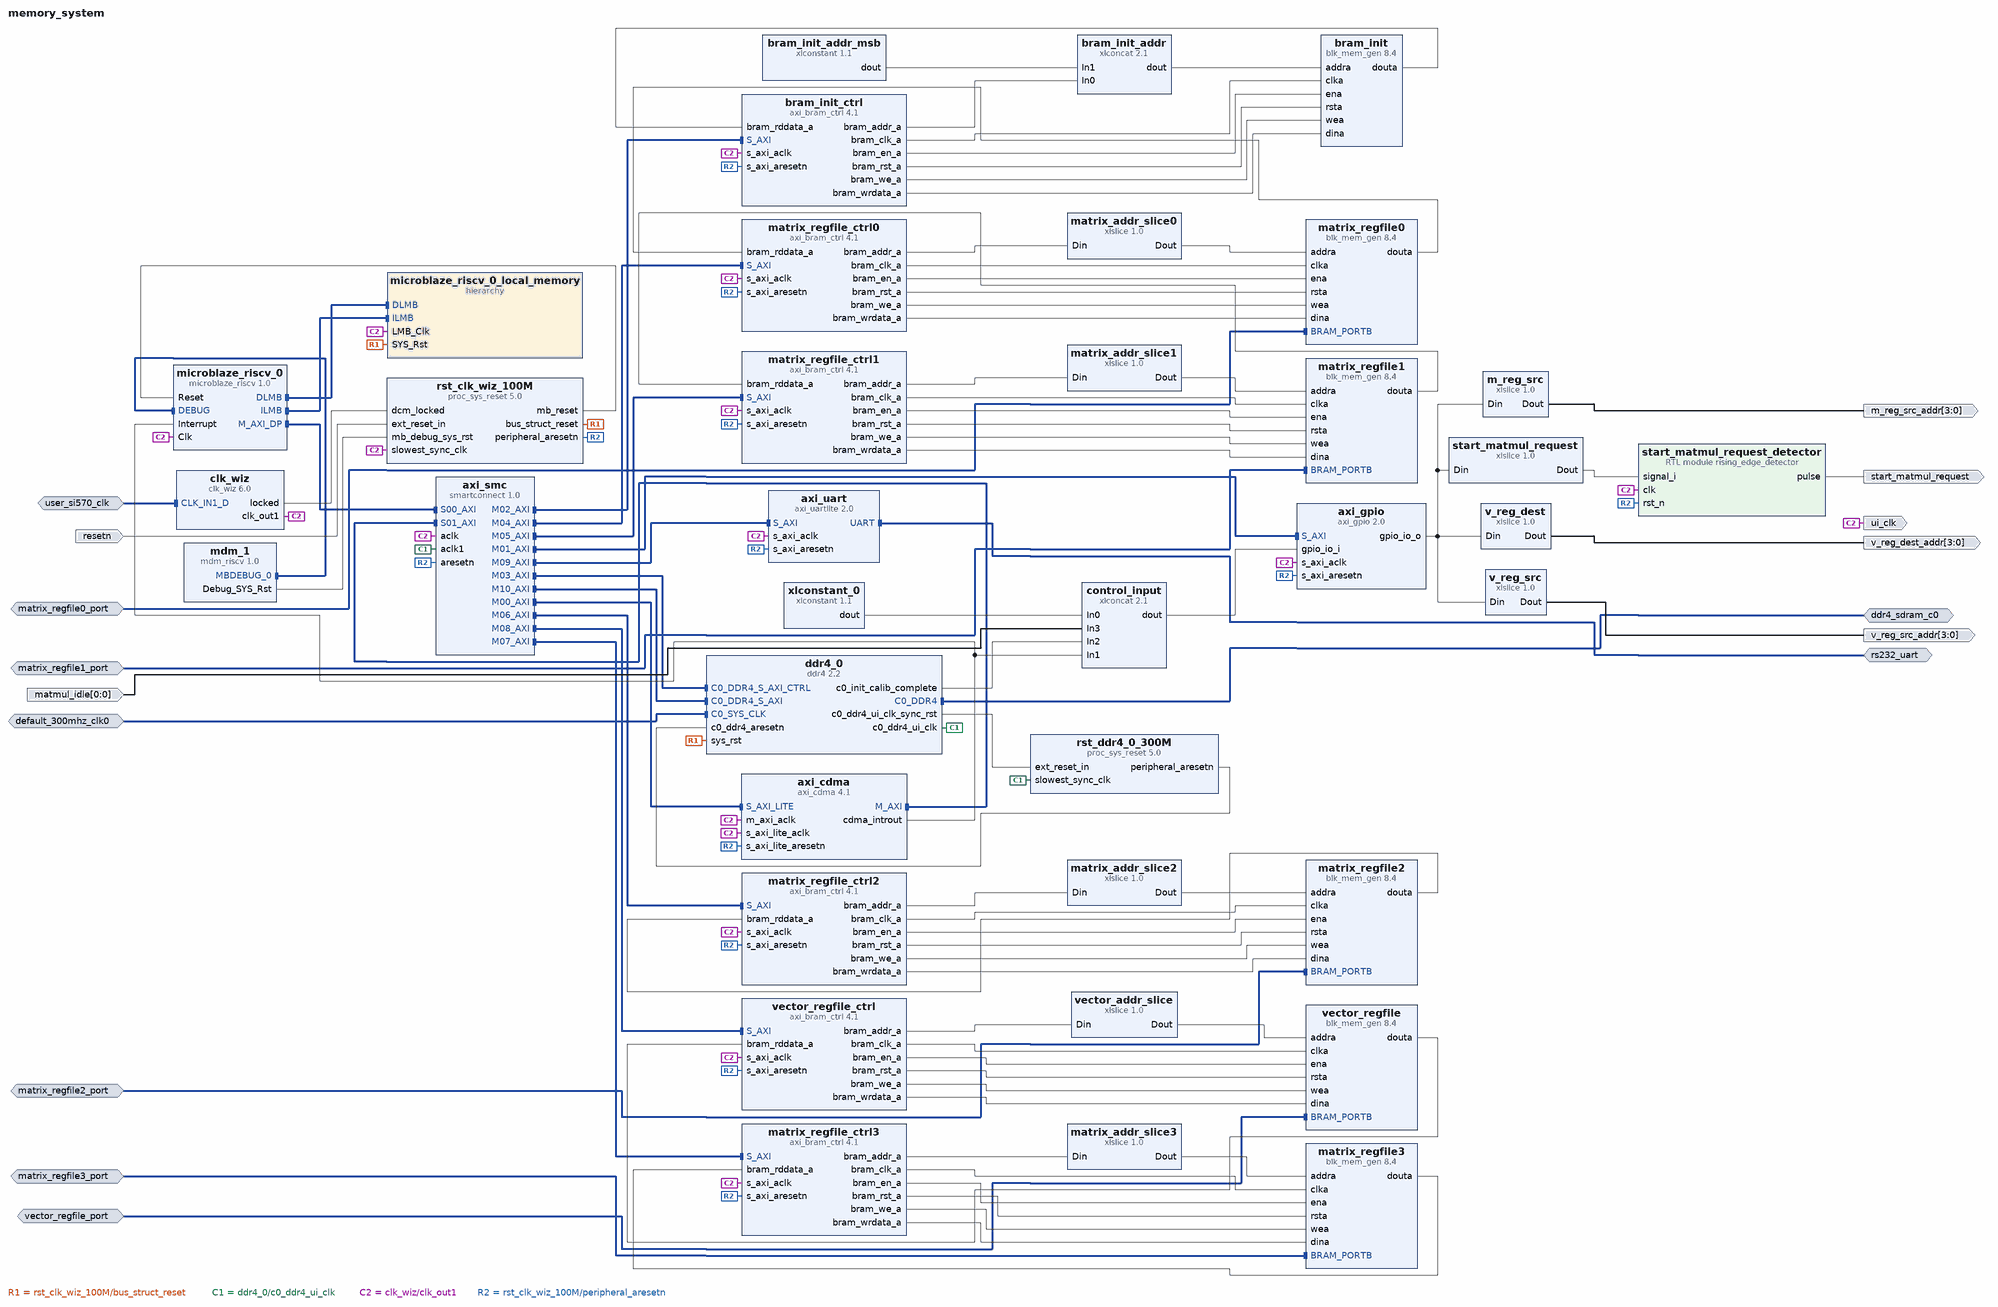
[diagram p0: block diagram of the top level]
# Vivado block design memory_system, xcu250-figd2104-2L-e, Vivado 2024.1
create_bd_design memory_system

create_bd_intf_port -mode Slave -vlnv xilinx.com:interface:diff_clock_rtl:1.0 default_300mhz_clk0
set_property -dict {CONFIG.FREQ_HZ 300000000} [get_bd_intf_ports default_300mhz_clk0]
create_bd_intf_port -mode Slave -vlnv xilinx.com:interface:bram_rtl:1.0 vector_regfile_port
create_bd_intf_port -mode Slave -vlnv xilinx.com:interface:bram_rtl:1.0 matrix_regfile0_port
create_bd_intf_port -mode Slave -vlnv xilinx.com:interface:bram_rtl:1.0 matrix_regfile1_port
create_bd_intf_port -mode Slave -vlnv xilinx.com:interface:bram_rtl:1.0 matrix_regfile2_port
create_bd_intf_port -mode Slave -vlnv xilinx.com:interface:bram_rtl:1.0 matrix_regfile3_port
create_bd_intf_port -mode Master -vlnv xilinx.com:interface:uart_rtl:1.0 rs232_uart
create_bd_intf_port -mode Master -vlnv xilinx.com:interface:ddr4_rtl:1.0 ddr4_sdram_c0
create_bd_intf_port -mode Slave -vlnv xilinx.com:interface:diff_clock_rtl:1.0 user_si570_clk
set_property -dict {CONFIG.FREQ_HZ 156250000} [get_bd_intf_ports user_si570_clk]
create_bd_port -dir I -type rst resetn
set_property -dict {CONFIG.POLARITY ACTIVE_LOW} [get_bd_ports resetn]
create_bd_port -dir O -type clk ui_clk
create_bd_port -dir O -from 3 -to 0 v_reg_src_addr
create_bd_port -dir O -from 3 -to 0 m_reg_src_addr
create_bd_port -dir O -from 3 -to 0 v_reg_dest_addr
create_bd_port -dir I -from 0 -to 0 matmul_idle
create_bd_port -dir O start_matmul_request

create_bd_cell -type ip -vlnv xilinx.com:ip:axi_cdma:4.1 axi_cdma
set_property -dict [list \
  CONFIG.C_ADDR_WIDTH 35 \
  CONFIG.C_INCLUDE_SG 0 \
  CONFIG.C_M_AXI_DATA_WIDTH 1024 \
  CONFIG.C_M_AXI_MAX_BURST_LEN 32 \
] [get_bd_cells axi_cdma]
create_bd_cell -type ip -vlnv xilinx.com:ip:axi_bram_ctrl:4.1 bram_init_ctrl
set_property -dict {CONFIG.DATA_WIDTH 1024 CONFIG.READ_LATENCY 1 CONFIG.SINGLE_PORT_BRAM 1} [get_bd_cells bram_init_ctrl]
create_bd_cell -type ip -vlnv xilinx.com:ip:blk_mem_gen:8.4 bram_init
set_property -dict [list \
  CONFIG.Coe_File ../../../../imports/mem_system.srcs/ram_init.coe \
  CONFIG.EN_SAFETY_CKT false \
  CONFIG.Enable_32bit_Address true \
  CONFIG.Fill_Remaining_Memory_Locations true \
  CONFIG.Load_Init_File true \
  CONFIG.Memory_Type Single_Port_RAM \
  CONFIG.Operating_Mode_A WRITE_FIRST \
  CONFIG.Register_PortA_Output_of_Memory_Core false \
  CONFIG.Register_PortA_Output_of_Memory_Primitives false \
  CONFIG.Remaining_Memory_Locations deadbeef \
  CONFIG.Use_RSTA_Pin true \
  CONFIG.Write_Depth_A 8192 \
  CONFIG.Write_Width_A 1024 \
  CONFIG.use_bram_block Stand_Alone \
] [get_bd_cells bram_init]
create_bd_cell -type ip -vlnv xilinx.com:ip:clk_wiz:6.0 clk_wiz
set_property -dict [list \
  CONFIG.AUTO_PRIMITIVE PLL \
  CONFIG.CLKIN1_JITTER_PS 64.0 \
  CONFIG.CLKOUT1_DRIVES Buffer \
  CONFIG.CLKOUT1_JITTER 87.637 \
  CONFIG.CLKOUT1_PHASE_ERROR 76.682 \
  CONFIG.CLKOUT1_REQUESTED_OUT_FREQ 200.89286 \
  CONFIG.CLKOUT2_DRIVES Buffer \
  CONFIG.CLKOUT3_DRIVES Buffer \
  CONFIG.CLKOUT4_DRIVES Buffer \
  CONFIG.CLKOUT5_DRIVES Buffer \
  CONFIG.CLKOUT6_DRIVES Buffer \
  CONFIG.CLKOUT7_DRIVES Buffer \
  CONFIG.CLK_IN1_BOARD_INTERFACE Custom \
  CONFIG.FEEDBACK_SOURCE FDBK_AUTO \
  CONFIG.MMCM_BANDWIDTH OPTIMIZED \
  CONFIG.MMCM_CLKFBOUT_MULT_F 9 \
  CONFIG.MMCM_CLKIN1_PERIOD 6.400 \
  CONFIG.MMCM_CLKIN2_PERIOD 10.000 \
  CONFIG.MMCM_CLKOUT0_DIVIDE_F 7 \
  CONFIG.MMCM_COMPENSATION AUTO \
  CONFIG.MMCM_DIVCLK_DIVIDE 1 \
  CONFIG.OPTIMIZE_CLOCKING_STRUCTURE_EN true \
  CONFIG.PHASESHIFT_MODE WAVEFORM \
  CONFIG.PRIMITIVE Auto \
  CONFIG.PRIM_IN_FREQ 156.250 \
  CONFIG.PRIM_SOURCE Differential_clock_capable_pin \
  CONFIG.RESET_BOARD_INTERFACE Custom \
  CONFIG.USE_BOARD_FLOW true \
  CONFIG.USE_LOCKED true \
  CONFIG.USE_RESET false \
] [get_bd_cells clk_wiz]
create_bd_cell -type ip -vlnv xilinx.com:ip:proc_sys_reset:5.0 rst_clk_wiz_100M
set_property -dict {CONFIG.RESET_BOARD_INTERFACE resetn CONFIG.USE_BOARD_FLOW true} [get_bd_cells rst_clk_wiz_100M]
create_bd_cell -type ip -vlnv xilinx.com:ip:axi_bram_ctrl:4.1 vector_regfile_ctrl
set_property -dict {CONFIG.DATA_WIDTH 1024 CONFIG.READ_LATENCY 1 CONFIG.SINGLE_PORT_BRAM 1} [get_bd_cells vector_regfile_ctrl]
create_bd_cell -type ip -vlnv xilinx.com:ip:blk_mem_gen:8.4 vector_regfile
set_property -dict [list \
  CONFIG.Byte_Size 8 \
  CONFIG.EN_SAFETY_CKT false \
  CONFIG.Enable_32bit_Address false \
  CONFIG.Fill_Remaining_Memory_Locations true \
  CONFIG.Load_Init_File false \
  CONFIG.Memory_Type True_Dual_Port_RAM \
  CONFIG.Operating_Mode_A WRITE_FIRST \
  CONFIG.Register_PortA_Output_of_Memory_Core false \
  CONFIG.Register_PortA_Output_of_Memory_Primitives false \
  CONFIG.Register_PortB_Output_of_Memory_Primitives true \
  CONFIG.Remaining_Memory_Locations 0 \
  CONFIG.Use_Byte_Write_Enable true \
  CONFIG.Use_RSTA_Pin true \
  CONFIG.Use_RSTB_Pin true \
  CONFIG.Write_Depth_A 16 \
  CONFIG.Write_Width_A 1024 \
  CONFIG.Write_Width_B 1024 \
  CONFIG.use_bram_block Stand_Alone \
] [get_bd_cells vector_regfile]
create_bd_cell -type ip -vlnv xilinx.com:ip:blk_mem_gen:8.4 matrix_regfile0
set_property -dict [list \
  CONFIG.Byte_Size 8 \
  CONFIG.EN_SAFETY_CKT false \
  CONFIG.Enable_32bit_Address false \
  CONFIG.Fill_Remaining_Memory_Locations true \
  CONFIG.Load_Init_File false \
  CONFIG.Memory_Type True_Dual_Port_RAM \
  CONFIG.Operating_Mode_A WRITE_FIRST \
  CONFIG.Register_PortA_Output_of_Memory_Core false \
  CONFIG.Register_PortA_Output_of_Memory_Primitives false \
  CONFIG.Register_PortB_Output_of_Memory_Primitives true \
  CONFIG.Remaining_Memory_Locations 0 \
  CONFIG.Use_Byte_Write_Enable true \
  CONFIG.Use_RSTA_Pin true \
  CONFIG.Use_RSTB_Pin true \
  CONFIG.Write_Depth_A 64 \
  CONFIG.Write_Width_A 1024 \
  CONFIG.Write_Width_B 4096 \
  CONFIG.use_bram_block Stand_Alone \
] [get_bd_cells matrix_regfile0]
create_bd_cell -type ip -vlnv xilinx.com:ip:axi_bram_ctrl:4.1 matrix_regfile_ctrl0
set_property -dict {CONFIG.DATA_WIDTH 1024 CONFIG.READ_LATENCY 1 CONFIG.SINGLE_PORT_BRAM 1} [get_bd_cells matrix_regfile_ctrl0]
create_bd_cell -type ip -vlnv xilinx.com:ip:xlslice:1.0 vector_addr_slice
set_property -dict {CONFIG.DIN_FROM 10 CONFIG.DIN_TO 7 CONFIG.DIN_WIDTH 16} [get_bd_cells vector_addr_slice]
create_bd_cell -type ip -vlnv xilinx.com:ip:xlslice:1.0 matrix_addr_slice0
set_property -dict {CONFIG.DIN_FROM 12 CONFIG.DIN_TO 7 CONFIG.DIN_WIDTH 16} [get_bd_cells matrix_addr_slice0]
create_bd_cell -type ip -vlnv xilinx.com:ip:xlslice:1.0 matrix_addr_slice1
set_property -dict {CONFIG.DIN_FROM 12 CONFIG.DIN_TO 7 CONFIG.DIN_WIDTH 16} [get_bd_cells matrix_addr_slice1]
create_bd_cell -type ip -vlnv xilinx.com:ip:blk_mem_gen:8.4 matrix_regfile1
set_property -dict [list \
  CONFIG.Byte_Size 8 \
  CONFIG.EN_SAFETY_CKT false \
  CONFIG.Enable_32bit_Address false \
  CONFIG.Fill_Remaining_Memory_Locations true \
  CONFIG.Load_Init_File false \
  CONFIG.Memory_Type True_Dual_Port_RAM \
  CONFIG.Operating_Mode_A WRITE_FIRST \
  CONFIG.Register_PortA_Output_of_Memory_Core false \
  CONFIG.Register_PortA_Output_of_Memory_Primitives false \
  CONFIG.Register_PortB_Output_of_Memory_Primitives true \
  CONFIG.Remaining_Memory_Locations 0 \
  CONFIG.Use_Byte_Write_Enable true \
  CONFIG.Use_RSTA_Pin true \
  CONFIG.Use_RSTB_Pin true \
  CONFIG.Write_Depth_A 64 \
  CONFIG.Write_Width_A 1024 \
  CONFIG.Write_Width_B 4096 \
  CONFIG.use_bram_block Stand_Alone \
] [get_bd_cells matrix_regfile1]
create_bd_cell -type ip -vlnv xilinx.com:ip:axi_bram_ctrl:4.1 matrix_regfile_ctrl1
set_property -dict {CONFIG.DATA_WIDTH 1024 CONFIG.READ_LATENCY 1 CONFIG.SINGLE_PORT_BRAM 1} [get_bd_cells matrix_regfile_ctrl1]
create_bd_cell -type ip -vlnv xilinx.com:ip:xlslice:1.0 matrix_addr_slice2
set_property -dict {CONFIG.DIN_FROM 12 CONFIG.DIN_TO 7 CONFIG.DIN_WIDTH 16} [get_bd_cells matrix_addr_slice2]
create_bd_cell -type ip -vlnv xilinx.com:ip:blk_mem_gen:8.4 matrix_regfile2
set_property -dict [list \
  CONFIG.Byte_Size 8 \
  CONFIG.EN_SAFETY_CKT false \
  CONFIG.Enable_32bit_Address false \
  CONFIG.Fill_Remaining_Memory_Locations true \
  CONFIG.Load_Init_File false \
  CONFIG.Memory_Type True_Dual_Port_RAM \
  CONFIG.Operating_Mode_A WRITE_FIRST \
  CONFIG.Read_Width_B 4096 \
  CONFIG.Register_PortA_Output_of_Memory_Core false \
  CONFIG.Register_PortA_Output_of_Memory_Primitives false \
  CONFIG.Remaining_Memory_Locations 0 \
  CONFIG.Use_Byte_Write_Enable true \
  CONFIG.Use_RSTA_Pin true \
  CONFIG.Use_RSTB_Pin true \
  CONFIG.Write_Depth_A 64 \
  CONFIG.Write_Width_A 1024 \
  CONFIG.Write_Width_B 4096 \
  CONFIG.use_bram_block Stand_Alone \
] [get_bd_cells matrix_regfile2]
create_bd_cell -type ip -vlnv xilinx.com:ip:axi_bram_ctrl:4.1 matrix_regfile_ctrl2
set_property -dict {CONFIG.DATA_WIDTH 1024 CONFIG.READ_LATENCY 1 CONFIG.SINGLE_PORT_BRAM 1} [get_bd_cells matrix_regfile_ctrl2]
create_bd_cell -type ip -vlnv xilinx.com:ip:xlslice:1.0 matrix_addr_slice3
set_property -dict {CONFIG.DIN_FROM 12 CONFIG.DIN_TO 7 CONFIG.DIN_WIDTH 16} [get_bd_cells matrix_addr_slice3]
create_bd_cell -type ip -vlnv xilinx.com:ip:blk_mem_gen:8.4 matrix_regfile3
set_property -dict [list \
  CONFIG.Byte_Size 8 \
  CONFIG.EN_SAFETY_CKT false \
  CONFIG.Enable_32bit_Address false \
  CONFIG.Fill_Remaining_Memory_Locations true \
  CONFIG.Load_Init_File false \
  CONFIG.Memory_Type True_Dual_Port_RAM \
  CONFIG.Operating_Mode_A WRITE_FIRST \
  CONFIG.Read_Width_B 4096 \
  CONFIG.Register_PortA_Output_of_Memory_Core false \
  CONFIG.Register_PortA_Output_of_Memory_Primitives false \
  CONFIG.Remaining_Memory_Locations 0 \
  CONFIG.Use_Byte_Write_Enable true \
  CONFIG.Use_RSTA_Pin true \
  CONFIG.Use_RSTB_Pin true \
  CONFIG.Write_Depth_A 64 \
  CONFIG.Write_Width_A 1024 \
  CONFIG.Write_Width_B 4096 \
  CONFIG.use_bram_block Stand_Alone \
] [get_bd_cells matrix_regfile3]
create_bd_cell -type ip -vlnv xilinx.com:ip:axi_bram_ctrl:4.1 matrix_regfile_ctrl3
set_property -dict {CONFIG.DATA_WIDTH 1024 CONFIG.READ_LATENCY 1 CONFIG.SINGLE_PORT_BRAM 1} [get_bd_cells matrix_regfile_ctrl3]
create_bd_cell -type ip -vlnv xilinx.com:ip:microblaze_riscv:1.0 microblaze_riscv_0
set_property -dict [list \
  CONFIG.C_DEBUG_ENABLED 1 \
  CONFIG.C_D_AXI 1 \
  CONFIG.C_D_LMB 1 \
  CONFIG.C_ENABLE_DISCRETE_PORTS 0 \
  CONFIG.C_I_LMB 1 \
  CONFIG.C_NUMBER_OF_PC_BRK 8 \
  CONFIG.C_NUMBER_OF_RD_ADDR_BRK 4 \
  CONFIG.C_NUMBER_OF_WR_ADDR_BRK 4 \
  CONFIG.G_TEMPLATE_LIST 1 \
] [get_bd_cells microblaze_riscv_0]
create_bd_cell -type hier microblaze_riscv_0_local_memory
create_bd_cell -type ip -vlnv xilinx.com:ip:mdm_riscv:1.0 mdm_1
create_bd_cell -type ip -vlnv xilinx.com:ip:axi_gpio:2.0 axi_gpio
set_property -dict [list \
  CONFIG.C_ALL_INPUTS 0 \
  CONFIG.C_ALL_OUTPUTS 0 \
  CONFIG.C_GPIO_WIDTH 32 \
  CONFIG.C_INTERRUPT_PRESENT 0 \
  CONFIG.GPIO_BOARD_INTERFACE Custom \
  CONFIG.USE_BOARD_FLOW true \
] [get_bd_cells axi_gpio]
create_bd_cell -type ip -vlnv xilinx.com:ip:smartconnect:1.0 axi_smc
set_property -dict {CONFIG.NUM_CLKS 2 CONFIG.NUM_MI 11} [get_bd_cells axi_smc]
create_bd_cell -type ip -vlnv xilinx.com:ip:axi_uartlite:2.0 axi_uart
set_property -dict [list \
  CONFIG.C_BAUDRATE 115200 \
  CONFIG.UARTLITE_BOARD_INTERFACE rs232_uart \
  CONFIG.USE_BOARD_FLOW true \
] [get_bd_cells axi_uart]
create_bd_cell -type ip -vlnv xilinx.com:ip:xlslice:1.0 v_reg_src
set_property -dict {CONFIG.DIN_FROM 3} [get_bd_cells v_reg_src]
create_bd_cell -type ip -vlnv xilinx.com:ip:xlslice:1.0 m_reg_src
set_property -dict {CONFIG.DIN_FROM 7 CONFIG.DIN_TO 4} [get_bd_cells m_reg_src]
create_bd_cell -type ip -vlnv xilinx.com:ip:xlslice:1.0 v_reg_dest
set_property -dict {CONFIG.DIN_FROM 11 CONFIG.DIN_TO 8} [get_bd_cells v_reg_dest]
create_bd_cell -type ip -vlnv xilinx.com:ip:xlslice:1.0 start_matmul_request
set_property -dict {CONFIG.DIN_FROM 12 CONFIG.DIN_TO 12} [get_bd_cells start_matmul_request]
create_bd_cell -type ip -vlnv xilinx.com:ip:xlconcat:2.1 control_input
set_property -dict {CONFIG.NUM_PORTS 4} [get_bd_cells control_input]
create_bd_cell -type ip -vlnv xilinx.com:ip:xlconstant:1.1 xlconstant_0
set_property -dict {CONFIG.CONST_VAL 0 CONFIG.CONST_WIDTH 29} [get_bd_cells xlconstant_0]
create_bd_cell -type ip -vlnv xilinx.com:ip:xlconcat:2.1 bram_init_addr
set_property -dict {CONFIG.IN0_WIDTH 16 CONFIG.IN1_WIDTH 16} [get_bd_cells bram_init_addr]
create_bd_cell -type ip -vlnv xilinx.com:ip:xlconstant:1.1 bram_init_addr_msb
set_property -dict {CONFIG.CONST_VAL 0 CONFIG.CONST_WIDTH 16} [get_bd_cells bram_init_addr_msb]
create_bd_cell -type ip -vlnv xilinx.com:ip:ddr4:2.2 ddr4_0
set_property -dict [list \
  CONFIG.ADDN_UI_CLKOUT1_FREQ_HZ None \
  CONFIG.ADDN_UI_CLKOUT2_FREQ_HZ None \
  CONFIG.C0.DDR4_AUTO_AP_COL_A3 true \
  CONFIG.C0.DDR4_Mem_Add_Map ROW_COLUMN_BANK_INTLV \
  CONFIG.C0_CLOCK_BOARD_INTERFACE default_300mhz_clk0 \
  CONFIG.C0_DDR4_BOARD_INTERFACE ddr4_sdram_c0 \
  CONFIG.RESET_BOARD_INTERFACE resetn \
] [get_bd_cells ddr4_0]
create_bd_cell -type ip -vlnv xilinx.com:ip:proc_sys_reset:5.0 rst_ddr4_0_300M
create_bd_cell -type module -reference rising_edge_detector start_matmul_request_detector

# ---- hierarchy /microblaze_riscv_0_local_memory ----
current_bd_instance /microblaze_riscv_0_local_memory
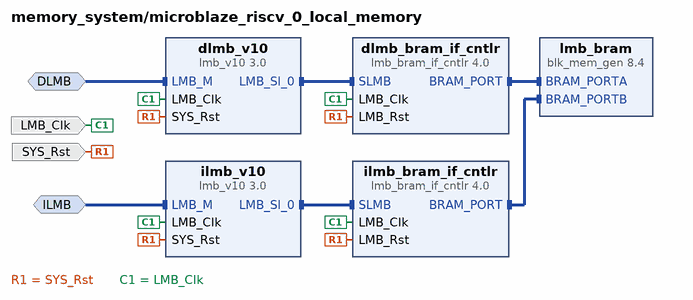
[diagram p1: block diagram inside /microblaze_riscv_0_local_memory]
create_bd_intf_pin -mode MirroredMaster -vlnv xilinx.com:interface:lmb_rtl:1.0 DLMB
create_bd_intf_pin -mode MirroredMaster -vlnv xilinx.com:interface:lmb_rtl:1.0 ILMB
create_bd_pin -dir I -type clk LMB_Clk
create_bd_pin -dir I -type rst SYS_Rst

create_bd_cell -type ip -vlnv xilinx.com:ip:lmb_v10:3.0 dlmb_v10
create_bd_cell -type ip -vlnv xilinx.com:ip:lmb_v10:3.0 ilmb_v10
create_bd_cell -type ip -vlnv xilinx.com:ip:lmb_bram_if_cntlr:4.0 dlmb_bram_if_cntlr
set_property -dict {CONFIG.C_ECC 0} [get_bd_cells dlmb_bram_if_cntlr]
create_bd_cell -type ip -vlnv xilinx.com:ip:lmb_bram_if_cntlr:4.0 ilmb_bram_if_cntlr
set_property -dict {CONFIG.C_ECC 0} [get_bd_cells ilmb_bram_if_cntlr]
create_bd_cell -type ip -vlnv xilinx.com:ip:blk_mem_gen:8.4 lmb_bram
set_property -dict {CONFIG.Memory_Type True_Dual_Port_RAM CONFIG.use_bram_block BRAM_Controller} [get_bd_cells lmb_bram]

# ---- connections ----

current_bd_instance /microblaze_riscv_0_local_memory
connect_bd_intf_net -intf_net microblaze_riscv_0_dlmb [get_bd_intf_pins dlmb_v10/LMB_M] [get_bd_intf_pins DLMB]
connect_bd_intf_net -intf_net microblaze_riscv_0_dlmb_bus [get_bd_intf_pins dlmb_v10/LMB_Sl_0] [get_bd_intf_pins dlmb_bram_if_cntlr/SLMB]
connect_bd_intf_net -intf_net microblaze_riscv_0_dlmb_cntlr [get_bd_intf_pins dlmb_bram_if_cntlr/BRAM_PORT] [get_bd_intf_pins lmb_bram/BRAM_PORTA]
connect_bd_intf_net -intf_net microblaze_riscv_0_ilmb [get_bd_intf_pins ilmb_v10/LMB_M] [get_bd_intf_pins ILMB]
connect_bd_intf_net -intf_net microblaze_riscv_0_ilmb_bus [get_bd_intf_pins ilmb_v10/LMB_Sl_0] [get_bd_intf_pins ilmb_bram_if_cntlr/SLMB]
connect_bd_intf_net -intf_net microblaze_riscv_0_ilmb_cntlr [get_bd_intf_pins ilmb_bram_if_cntlr/BRAM_PORT] [get_bd_intf_pins lmb_bram/BRAM_PORTB]
connect_bd_net [get_bd_pins SYS_Rst] \
  [get_bd_pins dlmb_v10/SYS_Rst] [get_bd_pins dlmb_bram_if_cntlr/LMB_Rst] [get_bd_pins ilmb_v10/SYS_Rst] \
  [get_bd_pins ilmb_bram_if_cntlr/LMB_Rst]
connect_bd_net -net microblaze_riscv_0_Clk [get_bd_pins LMB_Clk] \
  [get_bd_pins dlmb_v10/LMB_Clk] [get_bd_pins dlmb_bram_if_cntlr/LMB_Clk] [get_bd_pins ilmb_v10/LMB_Clk] \
  [get_bd_pins ilmb_bram_if_cntlr/LMB_Clk]
set_property HDL_ATTRIBUTE.BMM_INFO_ADDRESS_SPACE {byte  0x00000000 32 > memory_system microblaze_riscv_0_local_memory/lmb_bram} [get_bd_cells dlmb_bram_if_cntlr]
set_property HDL_ATTRIBUTE.KEEP_HIERARCHY yes [get_bd_cells dlmb_bram_if_cntlr]

current_bd_instance /
connect_bd_intf_net -intf_net BRAM_PORTB_1_1 [get_bd_intf_ports matrix_regfile0_port] [get_bd_intf_pins matrix_regfile0/BRAM_PORTB]
connect_bd_intf_net -intf_net BRAM_PORTB_2_1 [get_bd_intf_ports matrix_regfile1_port] [get_bd_intf_pins matrix_regfile1/BRAM_PORTB]
connect_bd_intf_net -intf_net BRAM_PORTB_3_1 [get_bd_intf_ports matrix_regfile2_port] [get_bd_intf_pins matrix_regfile2/BRAM_PORTB]
connect_bd_intf_net -intf_net BRAM_PORTB_4_1 [get_bd_intf_ports matrix_regfile3_port] [get_bd_intf_pins matrix_regfile3/BRAM_PORTB]
connect_bd_intf_net -intf_net CLK_IN1_D_0_1 [get_bd_intf_ports user_si570_clk] [get_bd_intf_pins clk_wiz/CLK_IN1_D]
connect_bd_intf_net [get_bd_intf_pins axi_cdma/M_AXI] [get_bd_intf_pins axi_smc/S01_AXI]
connect_bd_intf_net [get_bd_intf_pins axi_smc/M03_AXI] [get_bd_intf_pins ddr4_0/C0_DDR4_S_AXI_CTRL]
connect_bd_intf_net [get_bd_intf_pins axi_smc/M09_AXI] [get_bd_intf_pins axi_uart/S_AXI]
connect_bd_intf_net [get_bd_intf_pins axi_smc/M10_AXI] [get_bd_intf_pins ddr4_0/C0_DDR4_S_AXI]
connect_bd_intf_net -intf_net axi_uartlite_0_UART [get_bd_intf_ports rs232_uart] [get_bd_intf_pins axi_uart/UART]
connect_bd_intf_net [get_bd_intf_ports ddr4_sdram_c0] [get_bd_intf_pins ddr4_0/C0_DDR4]
connect_bd_intf_net -intf_net default_300mhz_clk0_1 [get_bd_intf_ports default_300mhz_clk0] [get_bd_intf_pins ddr4_0/C0_SYS_CLK]
connect_bd_intf_net [get_bd_intf_pins microblaze_riscv_0/M_AXI_DP] [get_bd_intf_pins axi_smc/S00_AXI]
connect_bd_intf_net [get_bd_intf_pins mdm_1/MBDEBUG_0] [get_bd_intf_pins microblaze_riscv_0/DEBUG]
connect_bd_intf_net [get_bd_intf_pins microblaze_riscv_0/DLMB] [get_bd_intf_pins microblaze_riscv_0_local_memory/DLMB]
connect_bd_intf_net [get_bd_intf_pins microblaze_riscv_0/ILMB] [get_bd_intf_pins microblaze_riscv_0_local_memory/ILMB]
connect_bd_intf_net -intf_net smartconnect_0_M00_AXI [get_bd_intf_pins axi_smc/M00_AXI] [get_bd_intf_pins axi_cdma/S_AXI_LITE]
connect_bd_intf_net -intf_net smartconnect_0_M01_AXI [get_bd_intf_pins axi_smc/M01_AXI] [get_bd_intf_pins axi_gpio/S_AXI]
connect_bd_intf_net -intf_net smartconnect_0_M02_AXI [get_bd_intf_pins axi_smc/M02_AXI] [get_bd_intf_pins bram_init_ctrl/S_AXI]
connect_bd_intf_net -intf_net smartconnect_0_M04_AXI [get_bd_intf_pins axi_smc/M04_AXI] [get_bd_intf_pins matrix_regfile_ctrl0/S_AXI]
connect_bd_intf_net -intf_net smartconnect_0_M05_AXI [get_bd_intf_pins axi_smc/M05_AXI] [get_bd_intf_pins matrix_regfile_ctrl1/S_AXI]
connect_bd_intf_net -intf_net smartconnect_0_M06_AXI [get_bd_intf_pins axi_smc/M06_AXI] [get_bd_intf_pins matrix_regfile_ctrl2/S_AXI]
connect_bd_intf_net -intf_net smartconnect_0_M07_AXI [get_bd_intf_pins axi_smc/M07_AXI] [get_bd_intf_pins matrix_regfile_ctrl3/S_AXI]
connect_bd_intf_net -intf_net smartconnect_0_M08_AXI [get_bd_intf_pins axi_smc/M08_AXI] [get_bd_intf_pins vector_regfile_ctrl/S_AXI]
connect_bd_intf_net [get_bd_intf_ports vector_regfile_port] [get_bd_intf_pins vector_regfile/BRAM_PORTB]
connect_bd_net -net In3_0_1 [get_bd_ports matmul_idle] [get_bd_pins control_input/In3]
connect_bd_net -net SYS_Rst_1 [get_bd_pins rst_clk_wiz_100M/bus_struct_reset] \
  [get_bd_pins microblaze_riscv_0_local_memory/SYS_Rst] [get_bd_pins ddr4_0/sys_rst]
connect_bd_net -net axi_bram_ctrl_0_bram1_douta [get_bd_pins vector_regfile/douta] [get_bd_pins vector_regfile_ctrl/bram_rddata_a]
connect_bd_net -net axi_bram_ctrl_0_bram_clk_a [get_bd_pins bram_init_ctrl/bram_clk_a] [get_bd_pins bram_init/clka]
connect_bd_net -net axi_bram_ctrl_0_bram_douta [get_bd_pins bram_init/douta] [get_bd_pins bram_init_ctrl/bram_rddata_a]
connect_bd_net -net axi_bram_ctrl_0_bram_en_a [get_bd_pins bram_init_ctrl/bram_en_a] [get_bd_pins bram_init/ena]
connect_bd_net -net axi_bram_ctrl_0_bram_rst_a [get_bd_pins bram_init_ctrl/bram_rst_a] [get_bd_pins bram_init/rsta]
connect_bd_net -net axi_bram_ctrl_0_bram_we_a [get_bd_pins bram_init_ctrl/bram_we_a] [get_bd_pins bram_init/wea]
connect_bd_net -net axi_bram_ctrl_0_bram_wrdata_a [get_bd_pins bram_init_ctrl/bram_wrdata_a] [get_bd_pins bram_init/dina]
connect_bd_net -net axi_bram_ctrl_1_bram_clk_a1 [get_bd_pins vector_regfile_ctrl/bram_clk_a] [get_bd_pins vector_regfile/clka]
connect_bd_net -net axi_bram_ctrl_1_bram_en_a1 [get_bd_pins vector_regfile_ctrl/bram_en_a] [get_bd_pins vector_regfile/ena]
connect_bd_net -net axi_bram_ctrl_1_bram_rst_a1 [get_bd_pins vector_regfile_ctrl/bram_rst_a] [get_bd_pins vector_regfile/rsta]
connect_bd_net -net axi_bram_ctrl_1_bram_we_a1 [get_bd_pins vector_regfile_ctrl/bram_we_a] [get_bd_pins vector_regfile/wea]
connect_bd_net -net axi_bram_ctrl_1_bram_wrdata_a1 [get_bd_pins vector_regfile_ctrl/bram_wrdata_a] [get_bd_pins vector_regfile/dina]
connect_bd_net [get_bd_pins axi_cdma/cdma_introut] [get_bd_pins microblaze_riscv_0/Interrupt] [get_bd_pins control_input/In1]
connect_bd_net [get_bd_pins axi_gpio/gpio_io_o] \
  [get_bd_pins v_reg_src/Din] [get_bd_pins m_reg_src/Din] [get_bd_pins v_reg_dest/Din] [get_bd_pins start_matmul_request/Din]
connect_bd_net [get_bd_pins bram_init_addr/dout] [get_bd_pins bram_init/addra]
connect_bd_net [get_bd_pins bram_init_addr_msb/dout] [get_bd_pins bram_init_addr/In1]
connect_bd_net [get_bd_pins bram_init_ctrl/bram_addr_a] [get_bd_pins bram_init_addr/In0]
connect_bd_net [get_bd_pins clk_wiz/locked] [get_bd_pins rst_clk_wiz_100M/dcm_locked]
connect_bd_net [get_bd_pins control_input/dout] [get_bd_pins axi_gpio/gpio_io_i]
connect_bd_net [get_bd_pins ddr4_0/c0_ddr4_ui_clk] [get_bd_pins axi_smc/aclk1] [get_bd_pins rst_ddr4_0_300M/slowest_sync_clk]
connect_bd_net [get_bd_pins ddr4_0/c0_ddr4_ui_clk_sync_rst] [get_bd_pins rst_ddr4_0_300M/ext_reset_in]
connect_bd_net [get_bd_pins ddr4_0/c0_init_calib_complete] [get_bd_pins control_input/In2]
connect_bd_net [get_bd_pins m_reg_src/Dout] [get_bd_ports m_reg_src_addr]
connect_bd_net -net matrix_regfile_ctrl_bram_addr_a [get_bd_pins matrix_regfile_ctrl0/bram_addr_a] [get_bd_pins matrix_addr_slice0/Din]
connect_bd_net -net matrix_regfile_ctrl_bram_addr_a1 [get_bd_pins matrix_regfile_ctrl1/bram_addr_a] [get_bd_pins matrix_addr_slice1/Din]
connect_bd_net -net matrix_regfile_ctrl_bram_addr_a2 [get_bd_pins matrix_regfile_ctrl2/bram_addr_a] [get_bd_pins matrix_addr_slice2/Din]
connect_bd_net -net matrix_regfile_ctrl_bram_addr_a3 [get_bd_pins matrix_regfile_ctrl3/bram_addr_a] [get_bd_pins matrix_addr_slice3/Din]
connect_bd_net -net matrix_regfile_ctrl_bram_clk_a [get_bd_pins matrix_regfile_ctrl0/bram_clk_a] [get_bd_pins matrix_regfile0/clka]
connect_bd_net -net matrix_regfile_ctrl_bram_clk_a1 [get_bd_pins matrix_regfile_ctrl1/bram_clk_a] [get_bd_pins matrix_regfile1/clka]
connect_bd_net -net matrix_regfile_ctrl_bram_clk_a2 [get_bd_pins matrix_regfile_ctrl2/bram_clk_a] [get_bd_pins matrix_regfile2/clka]
connect_bd_net -net matrix_regfile_ctrl_bram_clk_a3 [get_bd_pins matrix_regfile_ctrl3/bram_clk_a] [get_bd_pins matrix_regfile3/clka]
connect_bd_net -net matrix_regfile_ctrl_bram_en_a [get_bd_pins matrix_regfile_ctrl0/bram_en_a] [get_bd_pins matrix_regfile0/ena]
connect_bd_net -net matrix_regfile_ctrl_bram_en_a1 [get_bd_pins matrix_regfile_ctrl1/bram_en_a] [get_bd_pins matrix_regfile1/ena]
connect_bd_net -net matrix_regfile_ctrl_bram_en_a2 [get_bd_pins matrix_regfile_ctrl2/bram_en_a] [get_bd_pins matrix_regfile2/ena]
connect_bd_net -net matrix_regfile_ctrl_bram_en_a3 [get_bd_pins matrix_regfile_ctrl3/bram_en_a] [get_bd_pins matrix_regfile3/ena]
connect_bd_net -net matrix_regfile_ctrl_bram_rst_a [get_bd_pins matrix_regfile_ctrl0/bram_rst_a] [get_bd_pins matrix_regfile0/rsta]
connect_bd_net -net matrix_regfile_ctrl_bram_rst_a1 [get_bd_pins matrix_regfile_ctrl1/bram_rst_a] [get_bd_pins matrix_regfile1/rsta]
connect_bd_net -net matrix_regfile_ctrl_bram_rst_a2 [get_bd_pins matrix_regfile_ctrl2/bram_rst_a] [get_bd_pins matrix_regfile2/rsta]
connect_bd_net -net matrix_regfile_ctrl_bram_rst_a3 [get_bd_pins matrix_regfile_ctrl3/bram_rst_a] [get_bd_pins matrix_regfile3/rsta]
connect_bd_net -net matrix_regfile_ctrl_bram_we_a [get_bd_pins matrix_regfile_ctrl0/bram_we_a] [get_bd_pins matrix_regfile0/wea]
connect_bd_net -net matrix_regfile_ctrl_bram_we_a1 [get_bd_pins matrix_regfile_ctrl1/bram_we_a] [get_bd_pins matrix_regfile1/wea]
connect_bd_net -net matrix_regfile_ctrl_bram_we_a2 [get_bd_pins matrix_regfile_ctrl2/bram_we_a] [get_bd_pins matrix_regfile2/wea]
connect_bd_net -net matrix_regfile_ctrl_bram_we_a3 [get_bd_pins matrix_regfile_ctrl3/bram_we_a] [get_bd_pins matrix_regfile3/wea]
connect_bd_net -net matrix_regfile_ctrl_bram_wrdata_a [get_bd_pins matrix_regfile_ctrl0/bram_wrdata_a] [get_bd_pins matrix_regfile0/dina]
connect_bd_net -net matrix_regfile_ctrl_bram_wrdata_a1 [get_bd_pins matrix_regfile_ctrl1/bram_wrdata_a] [get_bd_pins matrix_regfile1/dina]
connect_bd_net -net matrix_regfile_ctrl_bram_wrdata_a2 [get_bd_pins matrix_regfile_ctrl2/bram_wrdata_a] [get_bd_pins matrix_regfile2/dina]
connect_bd_net -net matrix_regfile_ctrl_bram_wrdata_a3 [get_bd_pins matrix_regfile_ctrl3/bram_wrdata_a] [get_bd_pins matrix_regfile3/dina]
connect_bd_net -net matrix_regfile_douta [get_bd_pins matrix_regfile0/douta] [get_bd_pins matrix_regfile_ctrl0/bram_rddata_a]
connect_bd_net -net matrix_regfile_douta1 [get_bd_pins matrix_regfile1/douta] [get_bd_pins matrix_regfile_ctrl1/bram_rddata_a]
connect_bd_net -net matrix_regfile_douta2 [get_bd_pins matrix_regfile2/douta] [get_bd_pins matrix_regfile_ctrl2/bram_rddata_a]
connect_bd_net -net matrix_regfile_douta3 [get_bd_pins matrix_regfile3/douta] [get_bd_pins matrix_regfile_ctrl3/bram_rddata_a]
connect_bd_net [get_bd_pins mdm_1/Debug_SYS_Rst] [get_bd_pins rst_clk_wiz_100M/mb_debug_sys_rst]
connect_bd_net -net microblaze_riscv_0_Clk [get_bd_pins clk_wiz/clk_out1] \
  [get_bd_pins axi_cdma/m_axi_aclk] [get_bd_pins bram_init_ctrl/s_axi_aclk] [get_bd_pins rst_clk_wiz_100M/slowest_sync_clk] \
  [get_bd_pins axi_cdma/s_axi_lite_aclk] [get_bd_pins vector_regfile_ctrl/s_axi_aclk] \
  [get_bd_pins matrix_regfile_ctrl0/s_axi_aclk] [get_bd_pins matrix_regfile_ctrl1/s_axi_aclk] \
  [get_bd_pins matrix_regfile_ctrl2/s_axi_aclk] [get_bd_pins matrix_regfile_ctrl3/s_axi_aclk] \
  [get_bd_pins microblaze_riscv_0/Clk] [get_bd_pins microblaze_riscv_0_local_memory/LMB_Clk] \
  [get_bd_pins axi_gpio/s_axi_aclk] [get_bd_pins axi_smc/aclk] [get_bd_pins axi_uart/s_axi_aclk] [get_bd_ports ui_clk] \
  [get_bd_pins start_matmul_request_detector/clk]
connect_bd_net [get_bd_ports resetn] [get_bd_pins rst_clk_wiz_100M/ext_reset_in]
connect_bd_net -net rising_edge_detector_0_pulse [get_bd_pins start_matmul_request_detector/pulse] [get_bd_ports start_matmul_request]
connect_bd_net [get_bd_pins rst_clk_wiz_100M/mb_reset] [get_bd_pins microblaze_riscv_0/Reset]
connect_bd_net [get_bd_pins rst_clk_wiz_100M/peripheral_aresetn] \
  [get_bd_pins bram_init_ctrl/s_axi_aresetn] [get_bd_pins axi_cdma/s_axi_lite_aresetn] \
  [get_bd_pins vector_regfile_ctrl/s_axi_aresetn] [get_bd_pins matrix_regfile_ctrl0/s_axi_aresetn] \
  [get_bd_pins matrix_regfile_ctrl1/s_axi_aresetn] [get_bd_pins matrix_regfile_ctrl2/s_axi_aresetn] \
  [get_bd_pins matrix_regfile_ctrl3/s_axi_aresetn] [get_bd_pins axi_gpio/s_axi_aresetn] [get_bd_pins axi_smc/aresetn] \
  [get_bd_pins axi_uart/s_axi_aresetn] [get_bd_pins start_matmul_request_detector/rst_n]
connect_bd_net [get_bd_pins rst_ddr4_0_300M/peripheral_aresetn] [get_bd_pins ddr4_0/c0_ddr4_aresetn]
connect_bd_net [get_bd_pins start_matmul_request/Dout] [get_bd_pins start_matmul_request_detector/signal_i]
connect_bd_net [get_bd_pins v_reg_dest/Dout] [get_bd_ports v_reg_dest_addr]
connect_bd_net [get_bd_pins vector_regfile_ctrl/bram_addr_a] [get_bd_pins vector_addr_slice/Din]
connect_bd_net [get_bd_pins xlconstant_0/dout] [get_bd_pins control_input/In0]
connect_bd_net -net xlslice_0_Dout [get_bd_pins vector_addr_slice/Dout] [get_bd_pins vector_regfile/addra]
connect_bd_net -net xlslice_0_Dout1 [get_bd_pins v_reg_src/Dout] [get_bd_ports v_reg_src_addr]
connect_bd_net -net xlslice_1_Dout [get_bd_pins matrix_addr_slice0/Dout] [get_bd_pins matrix_regfile0/addra]
connect_bd_net -net xlslice_1_Dout1 [get_bd_pins matrix_addr_slice1/Dout] [get_bd_pins matrix_regfile1/addra]
connect_bd_net -net xlslice_1_Dout2 [get_bd_pins matrix_addr_slice2/Dout] [get_bd_pins matrix_regfile2/addra]
connect_bd_net -net xlslice_1_Dout3 [get_bd_pins matrix_addr_slice3/Dout] [get_bd_pins matrix_regfile3/addra]
set_property HDL_ATTRIBUTE.BMM_INFO_PROCESSOR {riscv > memory_system microblaze_riscv_0_local_memory/dlmb_bram_if_cntlr} [get_bd_cells microblaze_riscv_0]
set_property HDL_ATTRIBUTE.KEEP_HIERARCHY yes [get_bd_cells microblaze_riscv_0]

# ---- address map ----
assign_bd_address -offset 0x000020000 -range 64K -target_address_space [get_bd_addr_spaces axi_cdma/Data] [get_bd_addr_segs bram_init_ctrl/S_AXI/Mem0]
assign_bd_address -offset 0x000030000 -range 4K -target_address_space [get_bd_addr_spaces axi_cdma/Data] [get_bd_addr_segs vector_regfile_ctrl/S_AXI/Mem0]
assign_bd_address -offset 0x000032000 -range 8K -target_address_space [get_bd_addr_spaces axi_cdma/Data] [get_bd_addr_segs matrix_regfile_ctrl0/S_AXI/Mem0]
assign_bd_address -offset 0x000034000 -range 8K -target_address_space [get_bd_addr_spaces axi_cdma/Data] [get_bd_addr_segs matrix_regfile_ctrl1/S_AXI/Mem0]
assign_bd_address -offset 0x000036000 -range 8K -target_address_space [get_bd_addr_spaces axi_cdma/Data] [get_bd_addr_segs matrix_regfile_ctrl2/S_AXI/Mem0]
assign_bd_address -offset 0x000038000 -range 8K -target_address_space [get_bd_addr_spaces axi_cdma/Data] [get_bd_addr_segs matrix_regfile_ctrl3/S_AXI/Mem0]
assign_bd_address -offset 0x080000000 -range 2G -target_address_space [get_bd_addr_spaces axi_cdma/Data] [get_bd_addr_segs ddr4_0/C0_DDR4_MEMORY_MAP/C0_DDR4_ADDRESS_BLOCK]
exclude_bd_addr_seg -offset 0x040000000 -range 64K -target_address_space [get_bd_addr_spaces axi_cdma/Data] [get_bd_addr_segs axi_gpio/S_AXI/Reg]
exclude_bd_addr_seg -offset 0x040600000 -range 64K -target_address_space [get_bd_addr_spaces axi_cdma/Data] [get_bd_addr_segs axi_uart/S_AXI/Reg]
exclude_bd_addr_seg -offset 0x044A00000 -range 64K -target_address_space [get_bd_addr_spaces axi_cdma/Data] [get_bd_addr_segs axi_cdma/S_AXI_LITE/Reg]
exclude_bd_addr_seg -offset 0x044B00000 -range 1M -target_address_space [get_bd_addr_spaces axi_cdma/Data] [get_bd_addr_segs ddr4_0/C0_DDR4_MEMORY_MAP_CTRL/C0_REG]
assign_bd_address -offset 0x00000000 -range 128K -target_address_space [get_bd_addr_spaces microblaze_riscv_0/Data] [get_bd_addr_segs microblaze_riscv_0_local_memory/dlmb_bram_if_cntlr/SLMB/Mem]
assign_bd_address -offset 0x00020000 -range 64K -target_address_space [get_bd_addr_spaces microblaze_riscv_0/Data] [get_bd_addr_segs bram_init_ctrl/S_AXI/Mem0]
assign_bd_address -offset 0x00030000 -range 4K -target_address_space [get_bd_addr_spaces microblaze_riscv_0/Data] [get_bd_addr_segs vector_regfile_ctrl/S_AXI/Mem0]
assign_bd_address -offset 0x00032000 -range 8K -target_address_space [get_bd_addr_spaces microblaze_riscv_0/Data] [get_bd_addr_segs matrix_regfile_ctrl0/S_AXI/Mem0]
assign_bd_address -offset 0x00034000 -range 8K -target_address_space [get_bd_addr_spaces microblaze_riscv_0/Data] [get_bd_addr_segs matrix_regfile_ctrl1/S_AXI/Mem0]
assign_bd_address -offset 0x00036000 -range 8K -target_address_space [get_bd_addr_spaces microblaze_riscv_0/Data] [get_bd_addr_segs matrix_regfile_ctrl2/S_AXI/Mem0]
assign_bd_address -offset 0x00038000 -range 8K -target_address_space [get_bd_addr_spaces microblaze_riscv_0/Data] [get_bd_addr_segs matrix_regfile_ctrl3/S_AXI/Mem0]
assign_bd_address -offset 0x40000000 -range 64K -target_address_space [get_bd_addr_spaces microblaze_riscv_0/Data] [get_bd_addr_segs axi_gpio/S_AXI/Reg]
assign_bd_address -offset 0x40600000 -range 64K -target_address_space [get_bd_addr_spaces microblaze_riscv_0/Data] [get_bd_addr_segs axi_uart/S_AXI/Reg]
assign_bd_address -offset 0x44A00000 -range 64K -target_address_space [get_bd_addr_spaces microblaze_riscv_0/Data] [get_bd_addr_segs axi_cdma/S_AXI_LITE/Reg]
assign_bd_address -offset 0x44B00000 -range 1M -target_address_space [get_bd_addr_spaces microblaze_riscv_0/Data] [get_bd_addr_segs ddr4_0/C0_DDR4_MEMORY_MAP_CTRL/C0_REG]
assign_bd_address -offset 0x80000000 -range 2G -target_address_space [get_bd_addr_spaces microblaze_riscv_0/Data] [get_bd_addr_segs ddr4_0/C0_DDR4_MEMORY_MAP/C0_DDR4_ADDRESS_BLOCK]
assign_bd_address -offset 0x00000000 -range 128K -target_address_space [get_bd_addr_spaces microblaze_riscv_0/Instruction] [get_bd_addr_segs microblaze_riscv_0_local_memory/ilmb_bram_if_cntlr/SLMB/Mem]

validate_bd_design
save_bd_design
